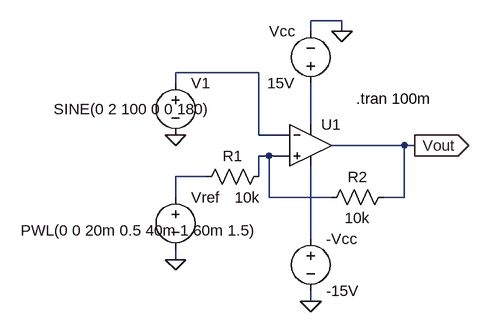
[diagram p0: schematic Q1.asc]
Q1.asc, the LTspice schematic file:
Version 4
SHEET 1 880 680
WIRE 304 -32 256 -32
WIRE 256 -16 256 -32
WIRE 304 -16 304 -32
WIRE 176 48 48 48
WIRE 48 64 48 48
WIRE 256 128 256 64
WIRE 176 144 176 48
WIRE 224 144 176 144
WIRE 400 160 288 160
WIRE 416 160 400 160
WIRE 192 176 176 176
WIRE 224 176 192 176
WIRE 96 208 48 208
WIRE 176 208 176 176
WIRE 48 240 48 208
WIRE 192 240 192 176
WIRE 288 240 192 240
WIRE 400 240 400 160
WIRE 400 240 368 240
WIRE 256 304 256 192
WIRE 48 336 48 320
WIRE 256 400 256 384
FLAG 304 -16 0
FLAG 48 336 0
FLAG 48 144 0
FLAG 256 400 0
FLAG 416 160 Vout
IOPIN 416 160 Out
SYMBOL Opamps\\UniversalOpamp2 256 160 R0
SYMATTR InstName U1
SYMBOL res 192 192 R90
WINDOW 0 0 56 VBottom 2
WINDOW 3 33 33 VTop 2
SYMATTR InstName R1
SYMATTR Value 10k
SYMBOL res 384 224 R90
WINDOW 0 0 56 VBottom 2
WINDOW 3 32 56 VTop 2
SYMATTR InstName R2
SYMATTR Value 10k
SYMBOL voltage 48 224 R0
WINDOW 123 0 0 Left 0
WINDOW 39 0 0 Left 0
WINDOW 3 -238 67 Left 2
SYMATTR InstName Vref
SYMATTR Value PWL(0 0 20m 0.5 40m 1 60m 1.5)
SYMBOL voltage 48 48 R0
WINDOW 3 -187 56 Left 2
WINDOW 123 0 0 Left 0
WINDOW 39 0 0 Left 0
SYMATTR InstName V1
SYMATTR Value SINE(0 2 100 0 0 180)
SYMBOL voltage 256 80 R180
WINDOW 0 24 96 Left 2
WINDOW 3 24 16 Left 2
SYMATTR InstName Vcc
SYMATTR Value 15V
SYMBOL voltage 256 288 R0
WINDOW 123 0 0 Left 0
WINDOW 39 0 0 Left 0
SYMATTR InstName -Vcc
SYMATTR Value -15V
TEXT 326 88 Left 2 !.tran 100m

The netlist it stands for:
* Q1.asc
XU1 N003 N001 N002 N005 Vout level.2 Avol=1Meg GBW=10Meg Slew=10Meg ilimit=25m rail=0 Vos=0 phimargin=45 en=0 enk=0 in=0 ink=0 Rin=500Meg  ; pins IN+ IN- V+ V- OUT
R1 N003 N004 10k
R2 Vout N003 10k
Vref N004 0 PWL(0 0 20m 0.5 40m 1 60m 1.5)
V1 N001 0 SINE(0 2 100 0 0 180)
Vcc N002 0 15V
V§-Vcc N005 0 -15V
.tran 100m
.lib UniversalOpamps2.sub
.backanno
.end